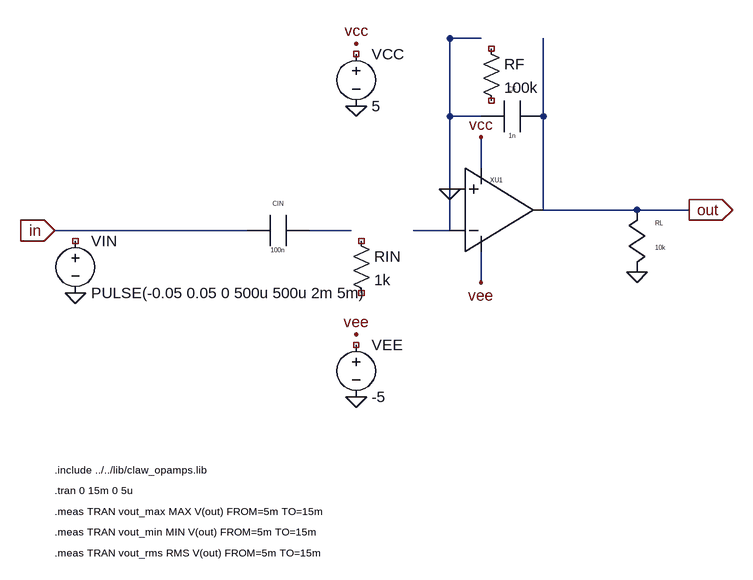
[diagram p0: schematic opamp_practical_differentiator.asc]
opamp_practical_differentiator.asc, the LTspice schematic file:
Version 4
SHEET 1 1261 1015
WIRE 64 336 360 336
WIRE 456 336 520 336
WIRE 616 336 672 336
WIRE 672 336 672 40
WIRE 672 40 720 40
WIRE 672 160 720 160
WIRE 816 40 816 304
WIRE 816 304 1040 304
WIRE 672 160 672 40
WIRE 720 240 720 192
WIRE 720 368 720 416
SYMBOL voltage 96 336 R0
SYMATTR InstName VIN
SYMATTR Value PULSE(-0.05 0.05 0 500u 500u 2m 5m)
SYMBOL voltage 528 48 R0
SYMATTR InstName VCC
SYMATTR Value 5
SYMBOL voltage 528 496 R0
SYMATTR InstName VEE
SYMATTR Value -5
SYMBOL cap_h 360 336 R0
SYMATTR InstName CIN
SYMATTR Value 100n
SYMBOL res 520 336 R0
SYMATTR InstName RIN
SYMATTR Value 1k
SYMBOL res 720 40 R0
SYMATTR InstName RF
SYMATTR Value 100k
SYMBOL cap_h 720 160 R0
SYMATTR InstName CF
SYMATTR Value 1n
SYMBOL opamp2 672 240 R0
SYMATTR InstName XU1
SYMATTR Value CLAW_IDEAL_OPAMP
SYMBOL res_v 960 304 R0
SYMATTR InstName RL
SYMATTR Value 10k
FLAG 64 336 in
IOPIN 64 336 In
FLAG 1040 304 out
IOPIN 1040 304 Out
FLAG 96 432 0
FLAG 672 272 0
FLAG 960 400 0
FLAG 528 48 vcc
FLAG 528 144 0
FLAG 528 496 vee
FLAG 528 592 0
FLAG 720 192 vcc
FLAG 720 416 vee
TEXT 64 704 Left 1 !.include ../../lib/claw_opamps.lib
TEXT 64 736 Left 1 !.tran 0 15m 0 5u
TEXT 64 768 Left 1 !.meas TRAN vout_max MAX V(out) FROM=5m TO=15m
TEXT 64 800 Left 1 !.meas TRAN vout_min MIN V(out) FROM=5m TO=15m
TEXT 64 832 Left 1 !.meas TRAN vout_rms RMS V(out) FROM=5m TO=15m

The netlist it stands for:
* opamp_practical_differentiator.asc
VIN NC_01 0 PULSE(-0.05 0.05 0 500u 500u 2m 5m)
VCC NC_02 0 5
VEE NC_03 0 -5
CIN in N001 100n
RIN NC_04 NC_05 1k
RF NC_06 NC_07 100k
CF 0 out 1n
XXU1 CLAW_IDEAL_OPAMP CLAW_IDEAL_OPAMP
RL out 0 10k
.include ../../lib/claw_opamps.lib
.tran 0 15m 0 5u
.meas TRAN vout_max MAX V(out) FROM=5m TO=15m
.meas TRAN vout_min MIN V(out) FROM=5m TO=15m
.meas TRAN vout_rms RMS V(out) FROM=5m TO=15m
.backanno
.end